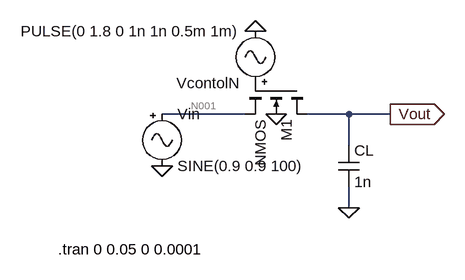
[diagram p0: schematic Lab 7 Fig 1a.asc]
Lab 7 Fig 1a.asc, the LTspice schematic file:
Version 4
SHEET 1 880 680
WIRE 16 176 -112 176
WIRE 176 176 112 176
WIRE 240 176 176 176
WIRE 176 224 176 176
WIRE 176 320 176 288
FLAG 240 176 Vout
IOPIN 240 176 Out
FLAG 176 320 0
FLAG 64 176 0
FLAG -112 256 0
FLAG 32 48 0
SYMBOL nmos4 112 128 R90
SYMATTR InstName M1
SYMATTR Value2 l=1u w=100u
SYMBOL cap 160 224 R0
SYMATTR InstName CL
SYMATTR Value 1n
SYMBOL Misc\\signal -112 160 R0
WINDOW 123 0 0 Left 0
WINDOW 39 0 0 Left 0
SYMATTR InstName Vin
SYMATTR Value SINE(0.9 0.9 100)
SYMBOL Misc\\signal 32 144 R180
WINDOW 123 0 0 Left 0
WINDOW 39 0 0 Left 0
SYMATTR InstName VcontolN
SYMATTR Value PULSE(0 1.8 0 1n 1n 0.5m 1m)
TEXT -272 384 Left 2 !.tran 0 0.05 0 0.0001

The netlist it stands for:
* Lab 7 Fig 1a.asc
M1 Vout P001 N001 0 NMOS l=1u w=100u
CL Vout 0 1n
Vin N001 0 SINE(0.9 0.9 100)
VcontolN P001 0 PULSE(0 1.8 0 1n 1n 0.5m 1m)
.model NMOS NMOS
.model PMOS PMOS
.lib standard.mos
.tran 0 0.05 0 0.0001
.backanno
.end

* Results of the author's LTspice run, read from the files saved beside the schematic
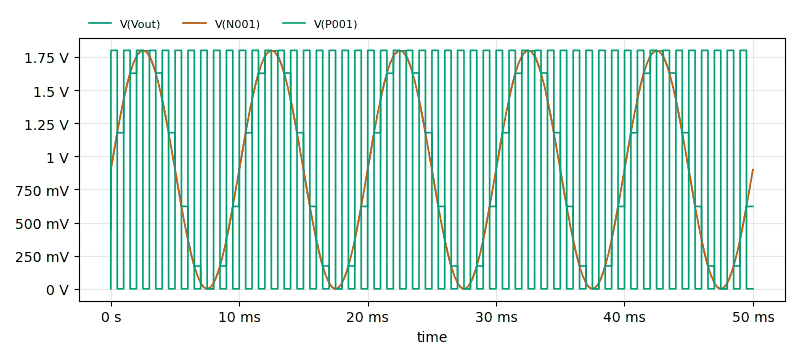
[diagram p1: Transient Analysis of Lab 7 Fig 1a.asc, plotted from the saved traces]
* Transient Analysis, 1 run:
*   V(Vout): min 0 V, max 1.796 V, average 899.7 mV, rms 1.102 V, last 621.7 mV
*   V(N001): min 0 V, max 1.8 V, average 899.9 mV, rms 1.103 V, last 900 mV
*   V(P001): min 0 V, max 1.8 V, average 900 mV, rms 1.273 V, last 0 V